# Altium schematic sheet Mezz1.SchDoc: FPGA Motherboard for Digital Multiplexed Readout, McGill U.
size B; DocumentNumber: DfMUX26; Revision: Rev0, Prototype; SheetNumber: 26; SheetTotal: 27; PageSetup: Record=PageOptions|CenterHorizontal=True|CenterVertical=True|PrintScale=1.08|XCorrection=1.00|YCorrection=1.00|PrintKind=0|BorderSize=5000000|LeftOffset=0|BottomOffset=0|Orientation=2|PaperLength=1000|PaperWidth=1000|Scale=100|PaperSource=7|PrintQuality=-4|MediaType=1|DitherType=10|PaperKind=Tabloid|PrintScaleMode=1
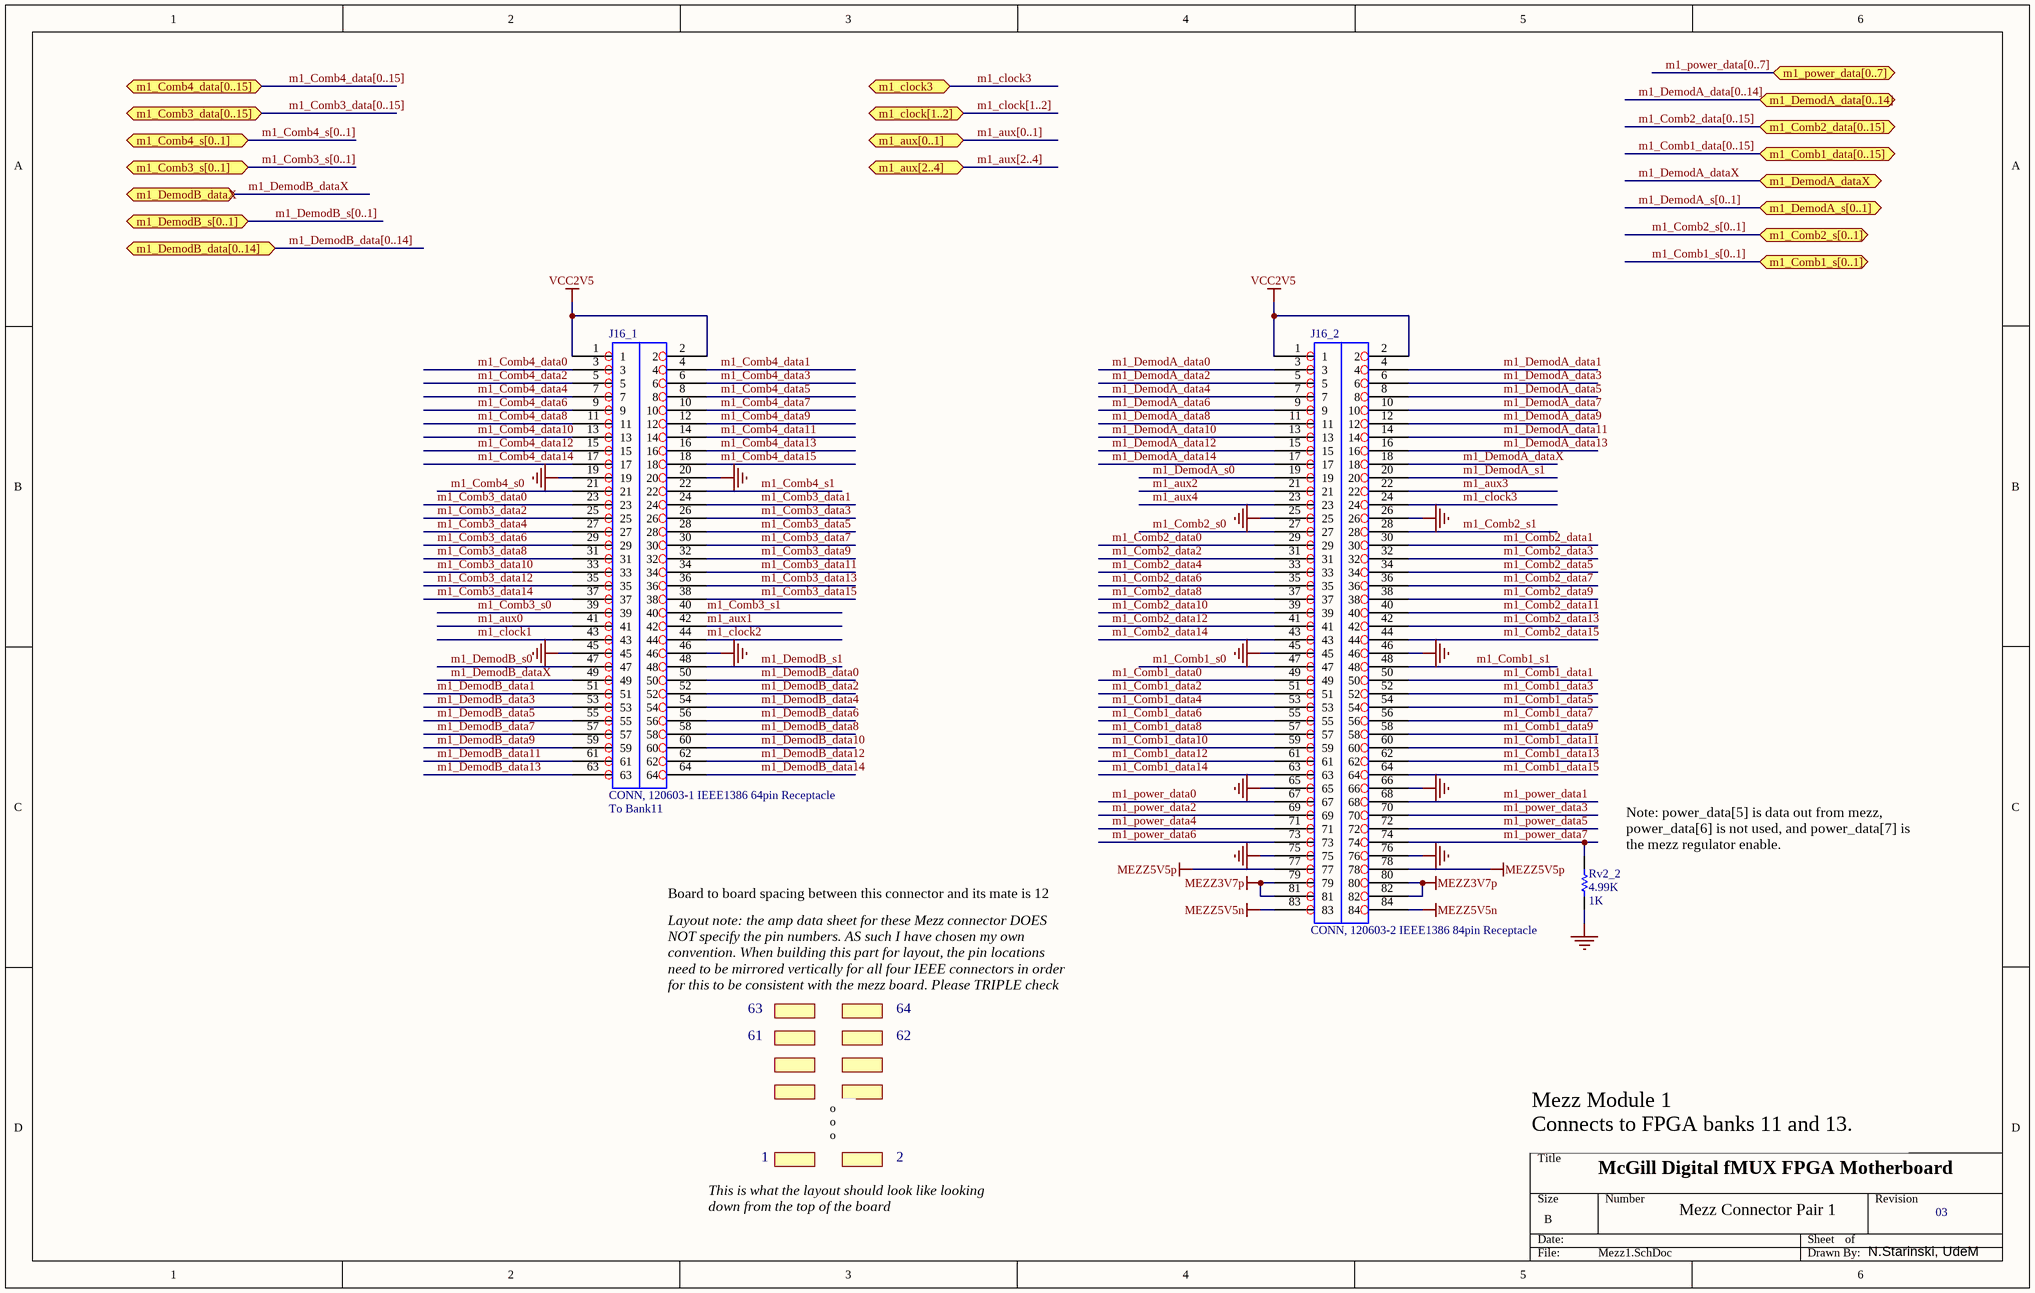
[diagram p0: Mezz1.SchDoc]

## Parts
J16_1  CONN, 120603-1 IEEE1386 64pin Receptacle  Relation: To Bank11  [120603-1]
J16_2  CONN, 120603-2 IEEE1386 84pin Receptacle  [120603-2]
Rv2_2  4.99K  value 1K  [1608[0603]]

## Ports
m1_aux[0..1] (bidir), m1_aux[2..4] (bidir), m1_clock3 (bidir), m1_clock[1..2] (bidir), m1_Comb1_data[0..15] (bidir), m1_Comb1_s[0..1] (bidir), m1_Comb2_data[0..15] (bidir), m1_Comb2_s[0..1] (bidir), m1_Comb3_data[0..15] (bidir), m1_Comb3_s[0..1] (bidir), m1_Comb4_data[0..15] (bidir), m1_Comb4_s[0..1] (bidir), m1_DemodA_data[0..14] (bidir), m1_DemodA_dataX (bidir), m1_DemodA_s[0..1] (bidir), m1_DemodB_data[0..14] (bidir), m1_DemodB_dataX (bidir), m1_DemodB_s[0..1] (bidir), m1_power_data[0..7]

## Nets
GND: J16_1.19 J16_1.20 J16_1.45 J16_1.46 J16_2.25 J16_2.26 J16_2.45 J16_2.46 J16_2.65 J16_2.66 J16_2.75 J16_2.76 Rv2_2.1
MEZZ3V7p: J16_2.79 J16_2.80 J16_2.81 J16_2.82
MEZZ5V5n: J16_2.83 J16_2.84
MEZZ5V5p: J16_2.77 J16_2.78
VCC2V5: J16_1.1 J16_1.2 J16_2.1 J16_2.2
m1_aux0: J16_1.41
m1_aux1: J16_1.42
m1_aux2: J16_2.21
m1_aux3: J16_2.22
m1_aux4: J16_2.23
m1_clock1: J16_1.43
m1_clock2: J16_1.44
m1_clock3: J16_2.24 ; port m1_clock3
m1_Comb1_data0: J16_2.49
m1_Comb1_data1: J16_2.50
m1_Comb1_data2: J16_2.51
m1_Comb1_data3: J16_2.52
m1_Comb1_data4: J16_2.53
m1_Comb1_data5: J16_2.54
m1_Comb1_data6: J16_2.55
m1_Comb1_data7: J16_2.56
m1_Comb1_data8: J16_2.57
m1_Comb1_data9: J16_2.58
m1_Comb1_data10: J16_2.59
m1_Comb1_data11: J16_2.60
m1_Comb1_data12: J16_2.61
m1_Comb1_data13: J16_2.62
m1_Comb1_data14: J16_2.63
m1_Comb1_data15: J16_2.64
m1_Comb1_s0: J16_2.47
m1_Comb1_s1: J16_2.48
m1_Comb2_data0: J16_2.29
m1_Comb2_data1: J16_2.30
m1_Comb2_data2: J16_2.31
m1_Comb2_data3: J16_2.32
m1_Comb2_data4: J16_2.33
m1_Comb2_data5: J16_2.34
m1_Comb2_data6: J16_2.35
m1_Comb2_data7: J16_2.36
m1_Comb2_data8: J16_2.37
m1_Comb2_data9: J16_2.38
m1_Comb2_data10: J16_2.39
m1_Comb2_data11: J16_2.40
m1_Comb2_data12: J16_2.41
m1_Comb2_data13: J16_2.42
m1_Comb2_data14: J16_2.43
m1_Comb2_data15: J16_2.44
m1_Comb2_s0: J16_2.27
m1_Comb2_s1: J16_2.28
m1_Comb3_data0: J16_1.23
m1_Comb3_data1: J16_1.24
m1_Comb3_data2: J16_1.25
m1_Comb3_data3: J16_1.26
m1_Comb3_data4: J16_1.27
m1_Comb3_data5: J16_1.28
m1_Comb3_data6: J16_1.29
m1_Comb3_data7: J16_1.30
m1_Comb3_data8: J16_1.31
m1_Comb3_data9: J16_1.32
m1_Comb3_data10: J16_1.33
m1_Comb3_data11: J16_1.34
m1_Comb3_data12: J16_1.35
m1_Comb3_data13: J16_1.36
m1_Comb3_data14: J16_1.37
m1_Comb3_data15: J16_1.38
m1_Comb3_s0: J16_1.39
m1_Comb3_s1: J16_1.40
m1_Comb4_data0: J16_1.3
m1_Comb4_data1: J16_1.4
m1_Comb4_data2: J16_1.5
m1_Comb4_data3: J16_1.6
m1_Comb4_data4: J16_1.7
m1_Comb4_data5: J16_1.8
m1_Comb4_data6: J16_1.9
m1_Comb4_data7: J16_1.10
m1_Comb4_data8: J16_1.11
m1_Comb4_data9: J16_1.12
m1_Comb4_data10: J16_1.13
m1_Comb4_data11: J16_1.14
m1_Comb4_data12: J16_1.15
m1_Comb4_data13: J16_1.16
m1_Comb4_data14: J16_1.17
m1_Comb4_data15: J16_1.18
m1_Comb4_s0: J16_1.21
m1_Comb4_s1: J16_1.22
m1_DemodA_data0: J16_2.3
m1_DemodA_data1: J16_2.4
m1_DemodA_data2: J16_2.5
m1_DemodA_data3: J16_2.6
m1_DemodA_data4: J16_2.7
m1_DemodA_data5: J16_2.8
m1_DemodA_data6: J16_2.9
m1_DemodA_data7: J16_2.10
m1_DemodA_data8: J16_2.11
m1_DemodA_data9: J16_2.12
m1_DemodA_data10: J16_2.13
m1_DemodA_data11: J16_2.14
m1_DemodA_data12: J16_2.15
m1_DemodA_data13: J16_2.16
m1_DemodA_data14: J16_2.17
m1_DemodA_dataX: J16_2.18 ; port m1_DemodA_dataX
m1_DemodA_s0: J16_2.19
m1_DemodA_s1: J16_2.20
m1_DemodB_data0: J16_1.50
m1_DemodB_data1: J16_1.51
m1_DemodB_data2: J16_1.52
m1_DemodB_data3: J16_1.53
m1_DemodB_data4: J16_1.54
m1_DemodB_data5: J16_1.55
m1_DemodB_data6: J16_1.56
m1_DemodB_data7: J16_1.57
m1_DemodB_data8: J16_1.58
m1_DemodB_data9: J16_1.59
m1_DemodB_data10: J16_1.60
m1_DemodB_data11: J16_1.61
m1_DemodB_data12: J16_1.62
m1_DemodB_data13: J16_1.63
m1_DemodB_data14: J16_1.64
m1_DemodB_dataX: J16_1.49 ; port m1_DemodB_dataX
m1_DemodB_s0: J16_1.47
m1_DemodB_s1: J16_1.48
m1_power_data0: J16_2.67
m1_power_data1: J16_2.68
m1_power_data2: J16_2.69
m1_power_data3: J16_2.70
m1_power_data4: J16_2.71
m1_power_data5: J16_2.72
m1_power_data6: J16_2.73
m1_power_data7: J16_2.74 Rv2_2.2

## Buses and harness runs
bus m1_aux[0..1] = port m1_aux[0..1]
bus m1_aux[2..4] = port m1_aux[2..4]
bus m1_clock[1..2] = port m1_clock[1..2]
bus m1_Comb1_data[0..15] = port m1_Comb1_data[0..15]
bus m1_Comb1_s[0..1] = port m1_Comb1_s[0..1]
bus m1_Comb2_data[0..15] = port m1_Comb2_data[0..15]
bus m1_Comb2_s[0..1] = port m1_Comb2_s[0..1]
bus m1_Comb3_data[0..15] = port m1_Comb3_data[0..15]
bus m1_Comb3_s[0..1] = port m1_Comb3_s[0..1]
bus m1_Comb4_data[0..15] = port m1_Comb4_data[0..15]
bus m1_Comb4_s[0..1] = port m1_Comb4_s[0..1]
bus m1_DemodA_data[0..14] = port m1_DemodA_data[0..14]
bus m1_DemodA_s[0..1] = port m1_DemodA_s[0..1]
bus m1_DemodB_data[0..14] = port m1_DemodB_data[0..14]
bus m1_DemodB_s[0..1] = port m1_DemodB_s[0..1]
bus m1_power_data[0..7] = port m1_power_data[0..7]

## Notes on the sheet
- Board to board spacing between this connector and its mate is 12 mm.
- (near Rv2_2) Note: power_data[5] is data out from mezz, power_data[6] is not used, and power_data[7] is the mezz regulator enable.
- Layout note: the amp data sheet for these Mezz connector DOES NOT specify the pin numbers. AS such I have chosen my own convention. When building this part for layout, the pin locations need to be mirrored vertically for all four IEEE connectors in order for this to be consistent with the mezz board. Please TRIPLE check that it mates properly with the mezz cards.
- 61
- 63
- 62
- 64
- 1
- o
  o
  o
- 2
- Mezz Module 1
  Connects to FPGA banks 11 and 13.
  Located on SYSACE side of board.
- McGill Digital fMUX FPGA Motherboard
- This is what the layout should look like looking down from the top of the board
- Mezz Connector Pair 1
- 03
- N.Starinski, UdeM

## Library data of the parts
J16_1 = 120603-1: 1.0mm FH (IEEE1386) 64-pin Connector
J16_2 = 120603-2: 1.0mm FH (IEEE1386) 84-pin Connector
Rv2_2 = Res Semi: Semiconductor Resistor; Published: 8-Jun-2000; LatestRevisionDate: 17-Jul-2002; LatestRevisionNote: Re-released for DXP Platform.; PackageReference: AXIAL-0.5; Publisher: Altium Limited